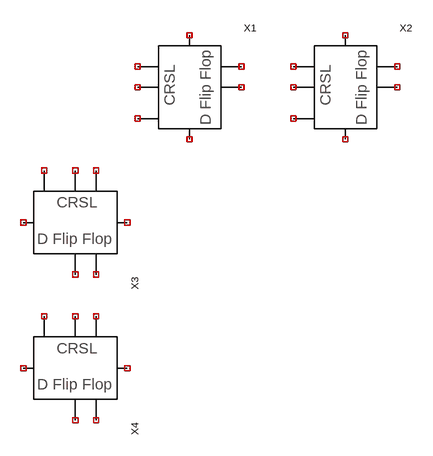
[diagram p0: schematic 4_Pixel_Array.asc]
4_Pixel_Array.asc, the LTspice schematic file:
Version 4
SHEET 1 880 680
SYMBOL CRSL_D_FlipFlop 144 112 R0
SYMATTR InstName X1
SYMBOL CRSL_D_FlipFlop 384 112 R0
SYMATTR InstName X2
SYMBOL CRSL_D_FlipFlop -32 320 R90
SYMATTR InstName X3
SYMBOL CRSL_D_FlipFlop -32 544 R90
SYMATTR InstName X4

The netlist it stands for:
* 4_Pixel_Array.asc
XX1 NC_01 NC_02 NC_03 NC_04 NC_05 NC_06 NC_07 CRSL_D_FlipFlop  ; pins D D_Prime Clock Q Q_Prime POS NEG
XX2 NC_08 NC_09 NC_10 NC_11 NC_12 NC_13 NC_14 CRSL_D_FlipFlop  ; pins D D_Prime Clock Q Q_Prime POS NEG
XX3 NC_15 NC_16 NC_17 NC_18 NC_19 NC_20 NC_21 CRSL_D_FlipFlop  ; pins D D_Prime Clock Q Q_Prime POS NEG
XX4 NC_22 NC_23 NC_24 NC_25 NC_26 NC_27 NC_28 CRSL_D_FlipFlop  ; pins D D_Prime Clock Q Q_Prime POS NEG
.backanno
.end